# EAGLE design pcu (EAGLE 7.6.0)
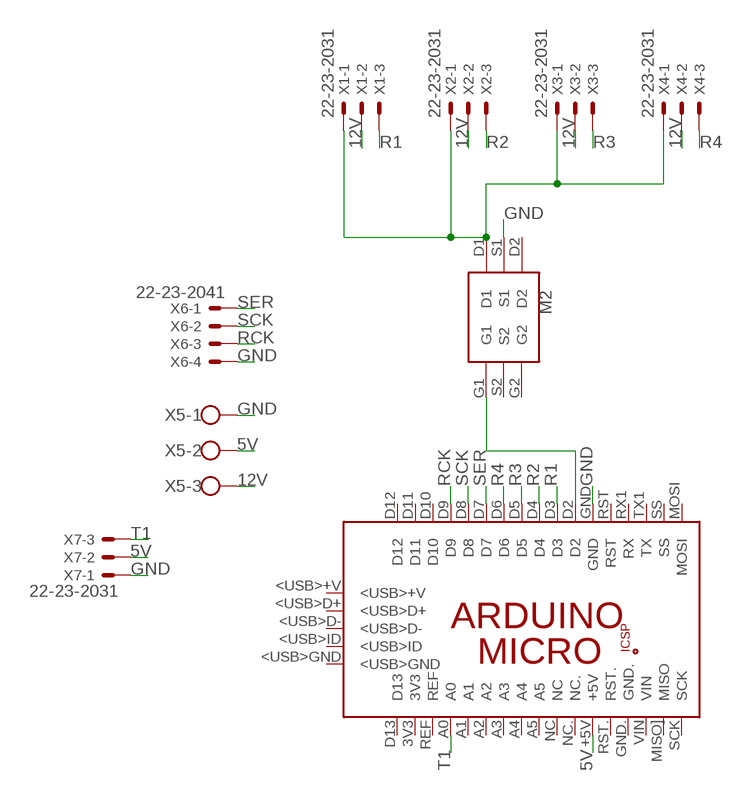
[diagram p0: schematic, sheet 1]

## Parts
M2  FDC6305N  [FDC6305]
PCB1  ARDUINO_MICRO  [ARDUINO_MICRO]
X1  22-23-2031  [22-23-2031]
X2  22-23-2031  [22-23-2031]
X3  22-23-2031  [22-23-2031]
X4  22-23-2031  [22-23-2031]
X5  W237-103  [W237-103]
X6  22-23-2041  [22-23-2041]
X7  22-23-2031  [22-23-2031]

## Nets
5V: PCB1.+5V X5.2 X7.2
12V: X1.2 X2.2 X3.2 X4.2 X5.3
GND: M2.S1 PCB1.GND X5.1 X6.4 X7.1
N$1: M2.D1 X1.1 X2.1 X3.1 X4.1
N$2: M2.G1 PCB1.D2
R1: PCB1.D3 X1.3
R2: PCB1.D4 X2.3
R3: PCB1.D5 X3.3
R4: PCB1.D6 X4.3
RCK: PCB1.D9 X6.3
SCK: PCB1.D8 X6.2
SER: PCB1.D7 X6.1
T1: PCB1.A0 X7.3
Unconnected: M2.D2 M2.G2 M2.S2 PCB1.3V3 PCB1.5V PCB1.<USB>+V PCB1.<USB>D+ PCB1.<USB>D- PCB1.<USB>GND PCB1.<USB>ID PCB1.A1 PCB1.A2 PCB1.A3 PCB1.A4 PCB1.A5 PCB1.D10 PCB1.D11 PCB1.D12 PCB1.D13 PCB1.GND. PCB1.GND_ PCB1.MISO. PCB1.MISO](MISO) PCB1.MOSI PCB1.MOSI. PCB1.NC PCB1.NC. PCB1.REF PCB1.RESET.. PCB1.RST PCB1.RST. PCB1.RX1(RX) PCB1.SCK PCB1.SCK. PCB1.SS PCB1.TX1(TX) PCB1.VIN

## Library data of the parts
M2 = FDC6305N:FDC6305N
PCB1 = E14_Arduino_revC:ARDUINO_MICRO: Device for representing an Arduino Micro board with a footprint in an EAGLE design. Created by Dave Young for Element14. More EAGLE documentation at: http://www.element14.com/community/community/knode/cadsoft_eagle
X1-X4 X7 = con-molex:22-23-2031: .100" (2.54mm) Center Header - 3 Pin; MF: MOLEX; MPN: 22-23-2031; OC_FARNELL: 1462950; OC_NEWARK: 30C0862
X5 = con-wago-500:W237-103: WAGO SCREW CLAMP; MPN: 237-103; OC_FARNELL: unknown; OC_NEWARK: 18M7116
X6 = con-molex:22-23-2041: .100" (2.54mm) Center Header - 4 Pin; MF: MOLEX; MPN: 22-23-2041; OC_FARNELL: 1462920; OC_NEWARK: 38C0355

## Board
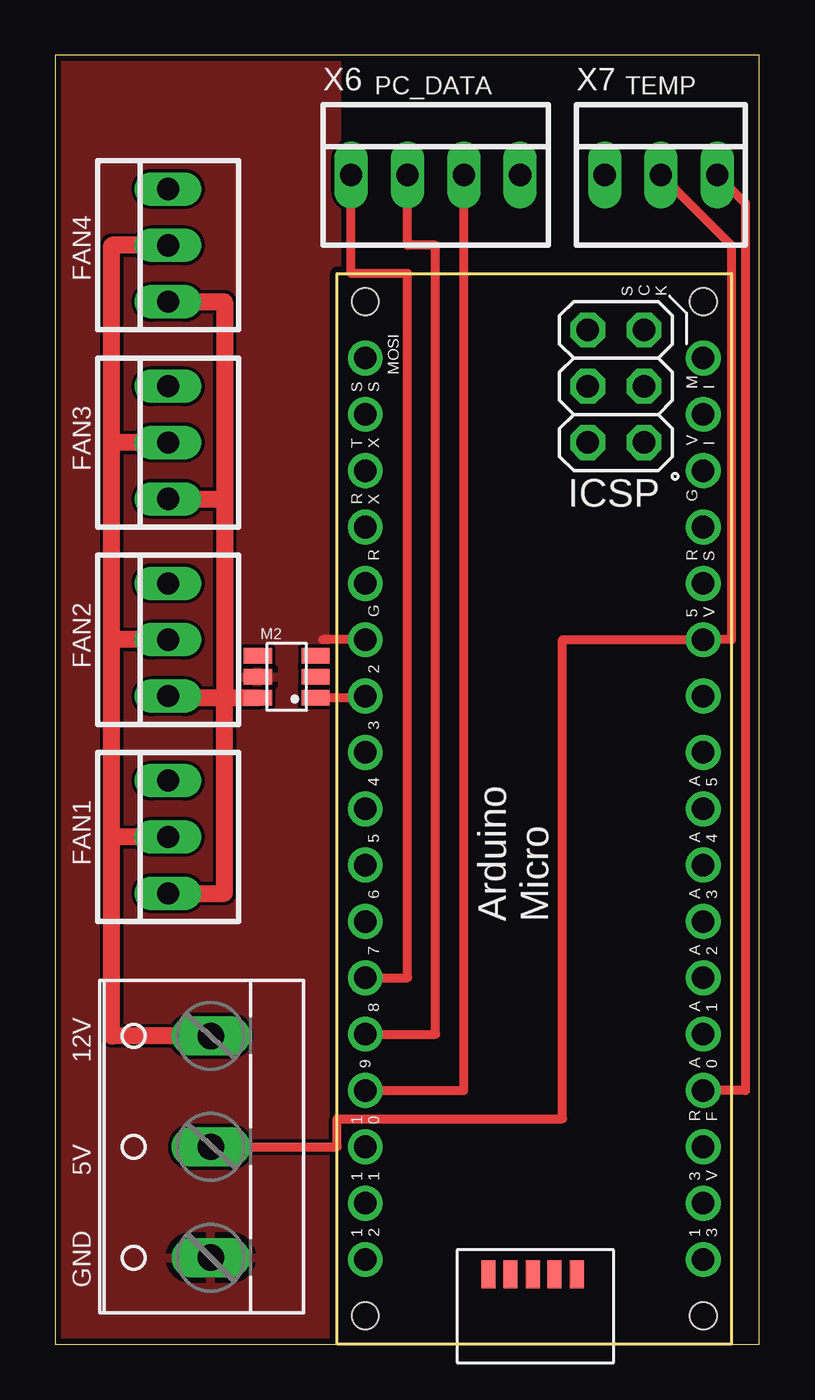
[diagram p1: board, top side]
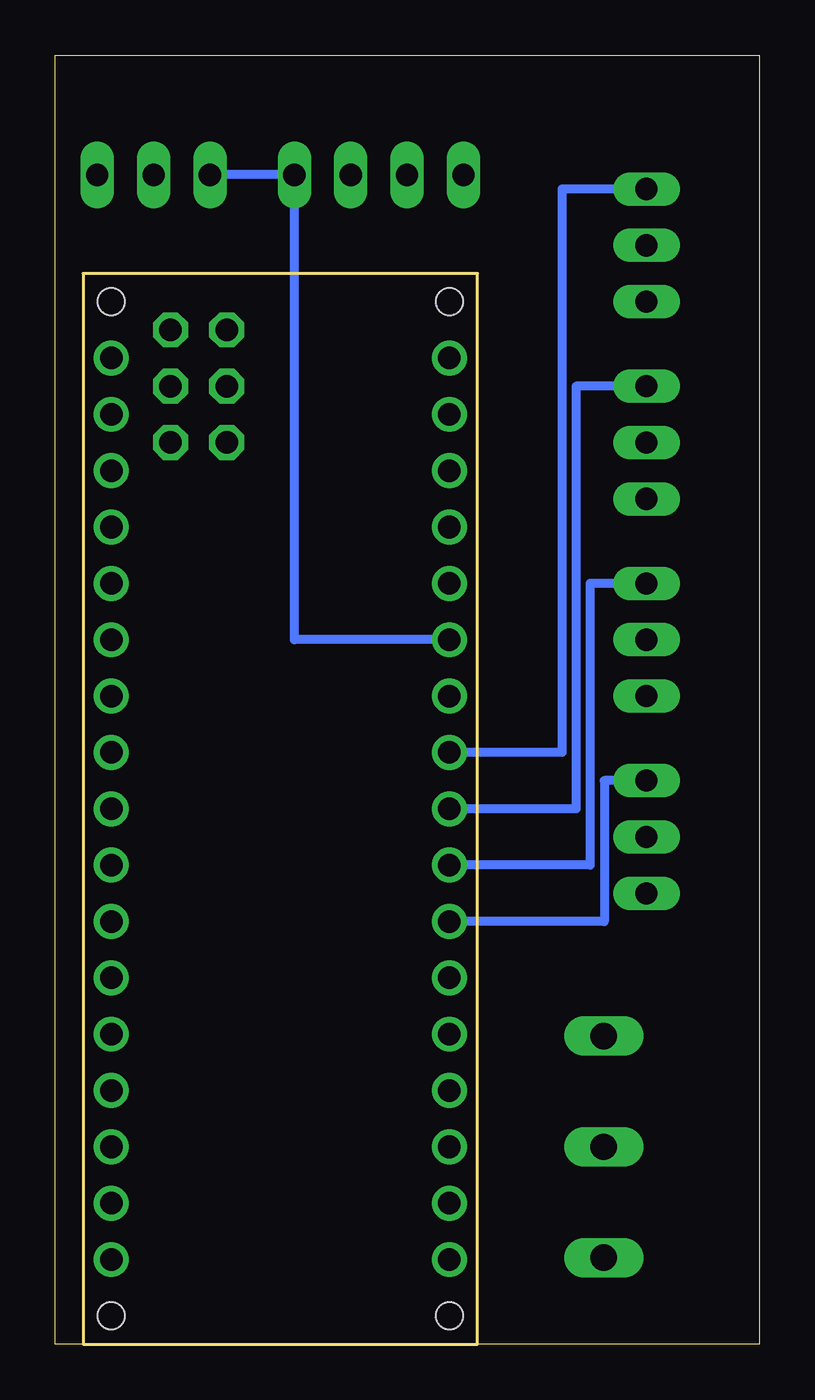
[diagram p2: board, bottom side, seen from below]

Size 31.73 x 58.09 mm. Coordinates in mm from the lower left corner, seen from the top.
Outline: 0,0 31.73,0 31.73,58.09 0,58.09 0,0
Copper layers (1*16): Top 0.035mm / dielectric 1.5mm / Bottom 0.035mm
Design rules "SeeedStudio_2layer_DRU_no_angle_20140221": minimum track width 6mil, minimum drill 12mil, track to track 6mil, track to pad 6mil, pad to pad 6mil, via to via 6mil, smd to smd 0mil, copper to edge 10mil, drill to drill 10mil, minimum pad ring 10mil, minimum via ring 6mil, stop-mask expansion 2mil, vias tented up to drill 100mil, thermal gap 10mil

### Footprints (pad centres in the part's own frame; a part is rotated, then mirrored left to right if it is on the bottom)
FDC6305 = smd 1.27 x 0.7: D1 -0.4,0.55; D2 -0.4,2.45; G1 2.2,0.55; G2 2.2,2.45; S1 -0.4,1.5; S2 2.2,1.5
ARDUINO_MICRO = drill 1.016 pad 1.575: 3V3 6.35,1.27; +5V 31.75,1.27; A0 11.43,1.27; A1 13.97,1.27; A2 16.51,1.27; A3 19.05,1.27; A4 21.59,1.27; A5 24.13,1.27; D2 29.21,16.51; D3 26.67,16.51; D4 24.13,16.51; D5 21.59,16.51; D6 19.05,16.51; D7 16.51,16.51; D8 13.97,16.51; D9 11.43,16.51; D10 8.89,16.51; D11 6.35,16.51; D12 3.81,16.51; D13 3.81,1.27; GND 31.75,16.51; GND. 36.83,1.27; MISO] 41.91,1.27; MOSI 44.45,16.51; NC 26.67,1.27; NC. 29.21,1.27; REF 8.89,1.27; RST 34.29,16.51; RST. 34.29,1.27; RX1 36.83,16.51; SCK 44.45,1.27; SS 41.91,16.51; TX1 39.37,16.51; VIN 39.37,1.27 | drill 1.016 pad 1.575 octagon: 5V 40.64,6.477; GND_ 45.72,6.477; MISO. 40.64,3.937; MOSI. 43.18,6.477; RESET.. 45.72,3.937; SCK. 43.18,3.937 | smd 1.27 x 0.635: <USB>+V 3.15,10.947; <USB>D+ 3.15,9.957; <USB>D- 3.15,8.941; <USB>GND 3.15,6.96; <USB>ID 3.15,7.976 | hole 1.2: 1.27,1.27; 1.27,16.51; 46.99,16.51; 46.99,1.27
22-23-2031 = drill 1 long: 1 -2.54,0; 2 0,0; 3 2.54,0
W237-103 = drill 1.194 long: 1 -5,-1.29; 2 0,-1.29; 3 5,-1.29
22-23-2041 = drill 1 long: 1 -3.81,0; 2 -1.27,0; 3 1.27,0; 4 3.81,0

### Placement (x,y rotation side)
M2  9.53,28.57 0 top
PCB1  30.48,0 90 top
X1  5.08,49.53 90 top
X2  5.08,40.64 90 top
X3  5.08,31.75 90 top
X4  5.08,22.86 90 top
X5  5.71,8.89 90 top
X6  17.14,52.7 0 top
X7  27.3,52.7 0 top

### Tracks (layer width: path | path; a pad name or v marks a point on that pad's centre or on a via)
5V
  Top 0.406: X5.2 12.7,8.89 12.7,10.16 22.86,10.16 22.86,31.75 PCB1.+5V 30.48,31.75 30.48,49.53 X7.2
12V
  Top 0.762: X5.3 2.54,13.89 2.54,22.86 | 2.54,22.86 2.54,31.75 | 2.54,31.75 2.54,40.64 | 2.54,40.64 2.54,49.53 X1.2 | X2.2 2.54,40.64 | X3.2 2.54,31.75 | X4.2 2.54,22.86
GND
  Top 0.406: PCB1.GND 12.06,31.75
  Bottom 0.406: PCB1.GND 20.95,31.75 X6.4 X7.1
  pour Top: 0,0 12.7,0 12.7,57.78 0,57.78
N$1
  Top 0.406: 5.08,29.12 X3.1
  Top 0.762: M2.D1 7.62,29.12 | 7.62,29.12 5.08,29.12 | X4.1 7.62,20.32 7.62,29.12 | X2.1 7.62,38.1 | 7.62,38.1 7.62,29.12 | X1.1 7.62,46.99 7.62,38.1
N$2
  Top 0.406: PCB1.D2 13.97,29.12 M2.G1
R1
  Bottom 0.406: X1.3 8.89,52.07 8.89,26.67 PCB1.D3
R2
  Bottom 0.406: X2.3 8.26,43.18 8.26,24.13 PCB1.D4
R3
  Bottom 0.406: X3.3 7.62,34.29 7.62,21.59 PCB1.D5
R4
  Bottom 0.406: X4.3 6.99,25.4 6.99,19.05 PCB1.D6
RCK
  Top 0.406: PCB1.D9 18.41,11.43 X6.3
SCK
  Top 0.406: PCB1.D8 17.14,13.97 17.14,49.53 15.88,49.53 X6.2
SER
  Top 0.406: PCB1.D7 15.88,16.51 15.88,48.26 13.34,48.26 X6.1
T1
  Top 0.406: X7.3 31.11,51.44 31.11,11.43 PCB1.A0

### Text on the board
tPlace: PC_DATA | TEMP | FAN4 | FAN3 | FAN2 | FAN1 | 12V | 5V | GND